# Altium schematic sheet PI_R3_REV1_MCU.SchDoc
size 500 x 500 mm
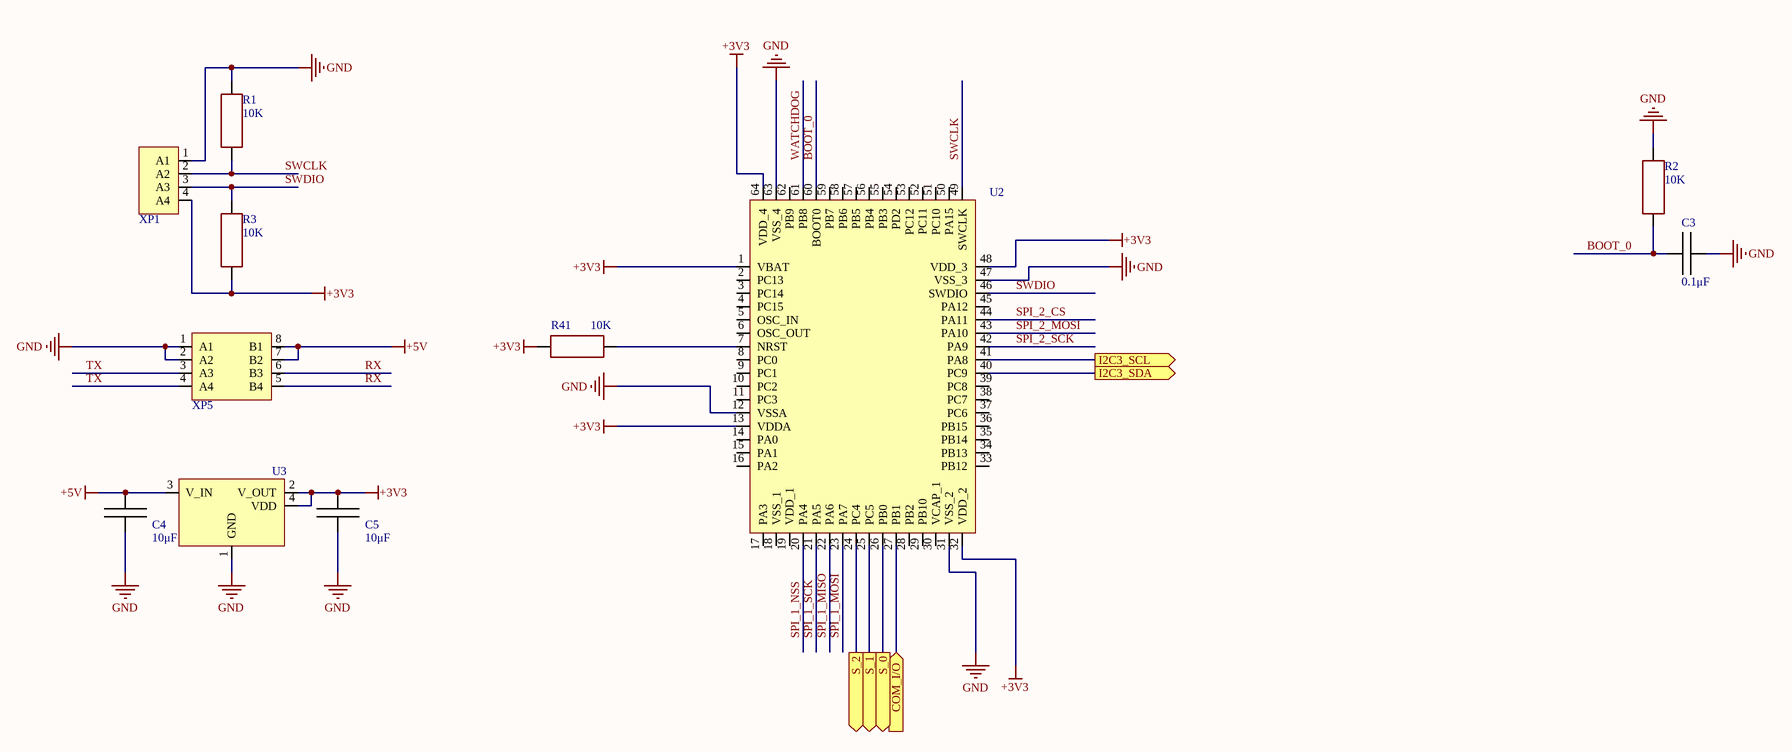
[diagram p0: PI_R3_REV1_MCU.SchDoc]

## Parts
C3  value 0.1μF  [CAP: 0402]  (hidden comment: Cap_0402)
C4  value 10μF  [CAP: 0805]  (hidden comment: Cap_0805)
C5  value 10μF  [CAP: 0805]  (hidden comment: Cap_0805)
R1  value 10K  [RES: 0402]
R2  value 10K  [RES: 0402]
R3  value 10K  [RES: 0402]
R41  value 10K  [RES: 0402]
U2  STM32F413RGT6  [LQFP-64]  (value not drawn)
U3  LD1117S33CTR4  [SOT-223-3]  (value not drawn)
XP1  PLS-6 (DS1021-1x6)  [PLS-4 (DS1021-1x4)]  (value not drawn)
XP5  55508-008TRLF  [55508-008TRLF]  (value not drawn)

## Ports
COM_I/O (in), I2C3_SCL (out), I2C3_SDA (out), S_0 (out), S_1 (out), S_2 (out)

## Nets
+3V3: C5.2 R3.1 R41.1 U2.1(VBAT) U2.13(VDDA) U2.32(VDD_2) U2.48(VDD_3) U2.64(VDD_4) U3.2(V_OUT) U3.4(VDD) XP1.4(A4)
+5V: C4.2 U3.3(V_IN) XP5.7(B2) XP5.8(B1)
GND: C3.1 C4.1 C5.1 R1.2 R2.1 U2.12(VSSA) U2.31(VSS_2) U2.47(VSS_3) U2.63(VSS_4) U3.1(GND) XP1.1(A1) XP5.1(A1) XP5.2(A2)
BOOT_0: C3.2 R2.2 U2.60(BOOT0)
COM_I/O: U2.27(PB1) ; port COM_I/O
I2C3_SCL: U2.41(PA8) ; port I2C3_SCL
I2C3_SDA: U2.40(PC9) ; port I2C3_SDA
RX: XP5.5(B4) XP5.6(B3)
S_0: U2.26(PB0) ; port S_0
S_1: U2.25(PC5) ; port S_1
S_2: U2.24(PC4) ; port S_2
SPI_1_MISO: U2.22(PA6)
SPI_1_MOSI: U2.23(PA7)
SPI_1_NSS: U2.20(PA4)
SPI_1_SCK: U2.21(PA5)
SPI_2_CS: U2.44(PA11)
SPI_2_MOSI: U2.43(PA10)
SPI_2_SCK: U2.42(PA9)
SWCLK: R1.1 U2.49(SWCLK) XP1.2(A2)
SWDIO: R3.2 U2.46(SWDIO) XP1.3(A3)
TX: XP5.3(A3) XP5.4(A4)
WATCHDOG: U2.61(PB8)
NetR41_2: R41.2 U2.7(NRST)

Not connected (* = marked no-connect by the designer): U2 2(PC13) 3(PC14) 4(PC15) 5(OSC_IN) 6(OSC_OUT) 8(PC0) 9(PC1) 10(PC2) 11(PC3) 14(PA0) 15(PA1) 16(PA2) 17(PA3) 18(VSS_1) 19(VDD_1) 28(PB2) 29(PB10) 30(VCAP_1) 33(PB12) 34(PB13) 35(PB14) 36(PB15) 37(PC6) 38(PC7) 39(PC8) 45(PA12) 50(PA15) 51(PC10) 52(PC11) 53(PC12) 54(PD2) 55(PB3) 56(PB4) 57(PB5) 58(PB6) 59(PB7) 62(PB9)

## Library data of the parts
C3 = Cap_0402: TypeDielectric: X7R(X5R); Voltage: ??V; Package/Case: 0402; Temperature: -55...+125°C(-55...+85°C); Product Category: Capacitors
C4 C5 = Cap_0805: TypeDielectric: X7R(X5R); Voltage: ??V; Package/Case: 0805; Temperature: -55...+125°C(-55...+85°C); Product Category: Capacitors
R1-R3 R41 = Resistor_0402: Tolerance: ±5%; Product Category: Resistors; Package/Case: 0402; Temperature: -55...+125°C
U2 = STM32F413RGT6: ARM Microcontrollers - MCU High-performance access line, Arm Cortex-M4 core DSP & FPU, 1 MByte of Flash 100; Manufacturer: STMicroelectronics; Datasheet: https://eu.mouser.com/datasheet/2/389/stm32f413cg-1851205.pdf; HelpURL: https://eu.mouser.com/ProductDetail/STMicroelectronics/STM32F413RGT6?qs=FNcb6ahWXRyREY%252BFzgYY7A%3D%3D; Package/Case: LQFP-64; Product Category: Microcontrollers
U3 = LD1117S33CTR: LDO Voltage Regulator 3.3V 0.8A Positive; Manufacturer: STMicroelectronics; Datasheet: https://eu.mouser.com/datasheet/2/389/cd00000544-1795431.pdf; HelpURL: https://eu.mouser.com/ProductDetail/STMicroelectronics/LD1117S33CTR?qs=8u%2FLf1IQwKF9meFZLHfRog%3D%3D; Package/Case: SOT-223-3; Product Category: Voltage Regulators
XP1 = PLS-4 (DS1021-1x4): Board to Board, Surface Mount, Single row, 6 Positions, 2.54mm, Vertical.; Manufacturer: Connfly; Datasheet: https://static.chipdip.ru/lib/977/DOC005977245.pdf; HelpURL: https://www.chipdip.by/product/pls-4; Product Category: Connectors
XP5 = 55508-008TRLF: Board to Board, Receptacle, Surface Mount, Double row, 8 Positions, 2mm (0.079inch), Vertical.; Manufacturer: Amphenol FCI; Datasheet: https://cdn.amphenol-cs.com/media/wysiwyg/files/documentation/datasheet/boardwiretoboard/bwb_minitek2mm_receptacle.pdf; HelpURL: https://eu.mouser.com/ProductDetail/Amphenol-FCI/55508-008TRLF?qs=u4%252BeTlRBLCQJeJ23kDZ66A%3D%3D; Product Category: Connectors